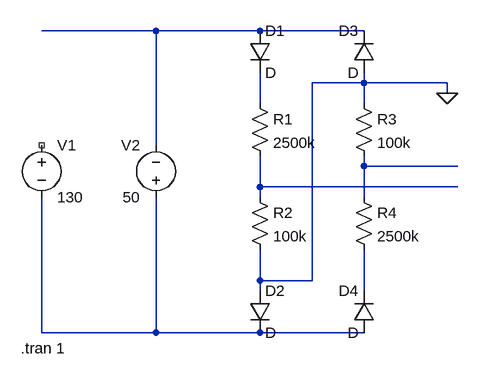
[diagram p0: schematic Two-way voltmeter.asc]
Two-way voltmeter.asc, the LTspice schematic file:
Version 4
SHEET 1 880 680
WIRE -16 80 -192 80
WIRE 144 80 -16 80
WIRE 304 80 144 80
WIRE 304 160 304 144
WIRE 304 160 224 160
WIRE 432 160 304 160
WIRE 432 176 432 160
WIRE 144 192 144 144
WIRE 304 192 304 160
WIRE -16 256 -16 80
WIRE 304 288 304 272
WIRE 448 288 304 288
WIRE 144 320 144 272
WIRE 448 320 144 320
WIRE 144 336 144 320
WIRE 304 336 304 288
WIRE 144 464 144 416
WIRE 224 464 224 160
WIRE 224 464 144 464
WIRE 144 480 144 464
WIRE 304 480 304 416
WIRE -192 544 -192 336
WIRE -16 544 -16 336
WIRE -16 544 -192 544
WIRE 144 544 -16 544
WIRE 304 544 144 544
FLAG 432 176 0
SYMBOL diode 128 80 R0
SYMATTR InstName D1
SYMBOL diode 128 480 R0
SYMATTR InstName D2
SYMBOL diode 320 144 R180
WINDOW 0 24 64 Left 2
WINDOW 3 24 0 Left 2
SYMATTR InstName D3
SYMBOL diode 320 544 R180
WINDOW 0 24 64 Left 2
WINDOW 3 24 0 Left 2
SYMATTR InstName D4
SYMBOL res 128 176 R0
SYMATTR InstName R1
SYMATTR Value 2500k
SYMBOL res 128 320 R0
SYMATTR InstName R2
SYMATTR Value 100k
SYMBOL res 288 176 R0
SYMATTR InstName R3
SYMATTR Value 100k
SYMBOL res 288 320 R0
SYMATTR InstName R4
SYMATTR Value 2500k
SYMBOL voltage -192 240 R0
WINDOW 123 0 0 Left 0
WINDOW 39 0 0 Left 0
SYMATTR InstName V1
SYMATTR Value 130
SYMBOL voltage -16 352 R180
WINDOW 0 24 96 Left 2
WINDOW 3 24 16 Left 2
WINDOW 123 0 0 Left 0
WINDOW 39 0 0 Left 0
SYMATTR InstName V2
SYMATTR Value 50
TEXT -224 568 Left 2 !.tran 1

The netlist it stands for:
* Two-way voltmeter.asc
D1 N001 N002 D
D2 0 N006 D
D3 0 N001 D
D4 N006 N005 D
R1 N002 N004 2500k
R2 N004 0 100k
R3 0 N003 100k
R4 N003 N005 2500k
V1 NC_01 N006 130
V2 N006 N001 50
.model D D
.lib standard.dio
.tran 1
.backanno
.end